# EasyEDA Pro project ProProject_三阶魔方机器人_2024-09-23.epro

# Schematic Schematic1
Create Date: 2023-12-15; Page Name: P1; Project Name: 三阶魔方机器人; Schematic Name: Schematic1; Update Date: 2023-12-15; Company: 嘉立创EDA; Page Size: A4; Version: V1.0
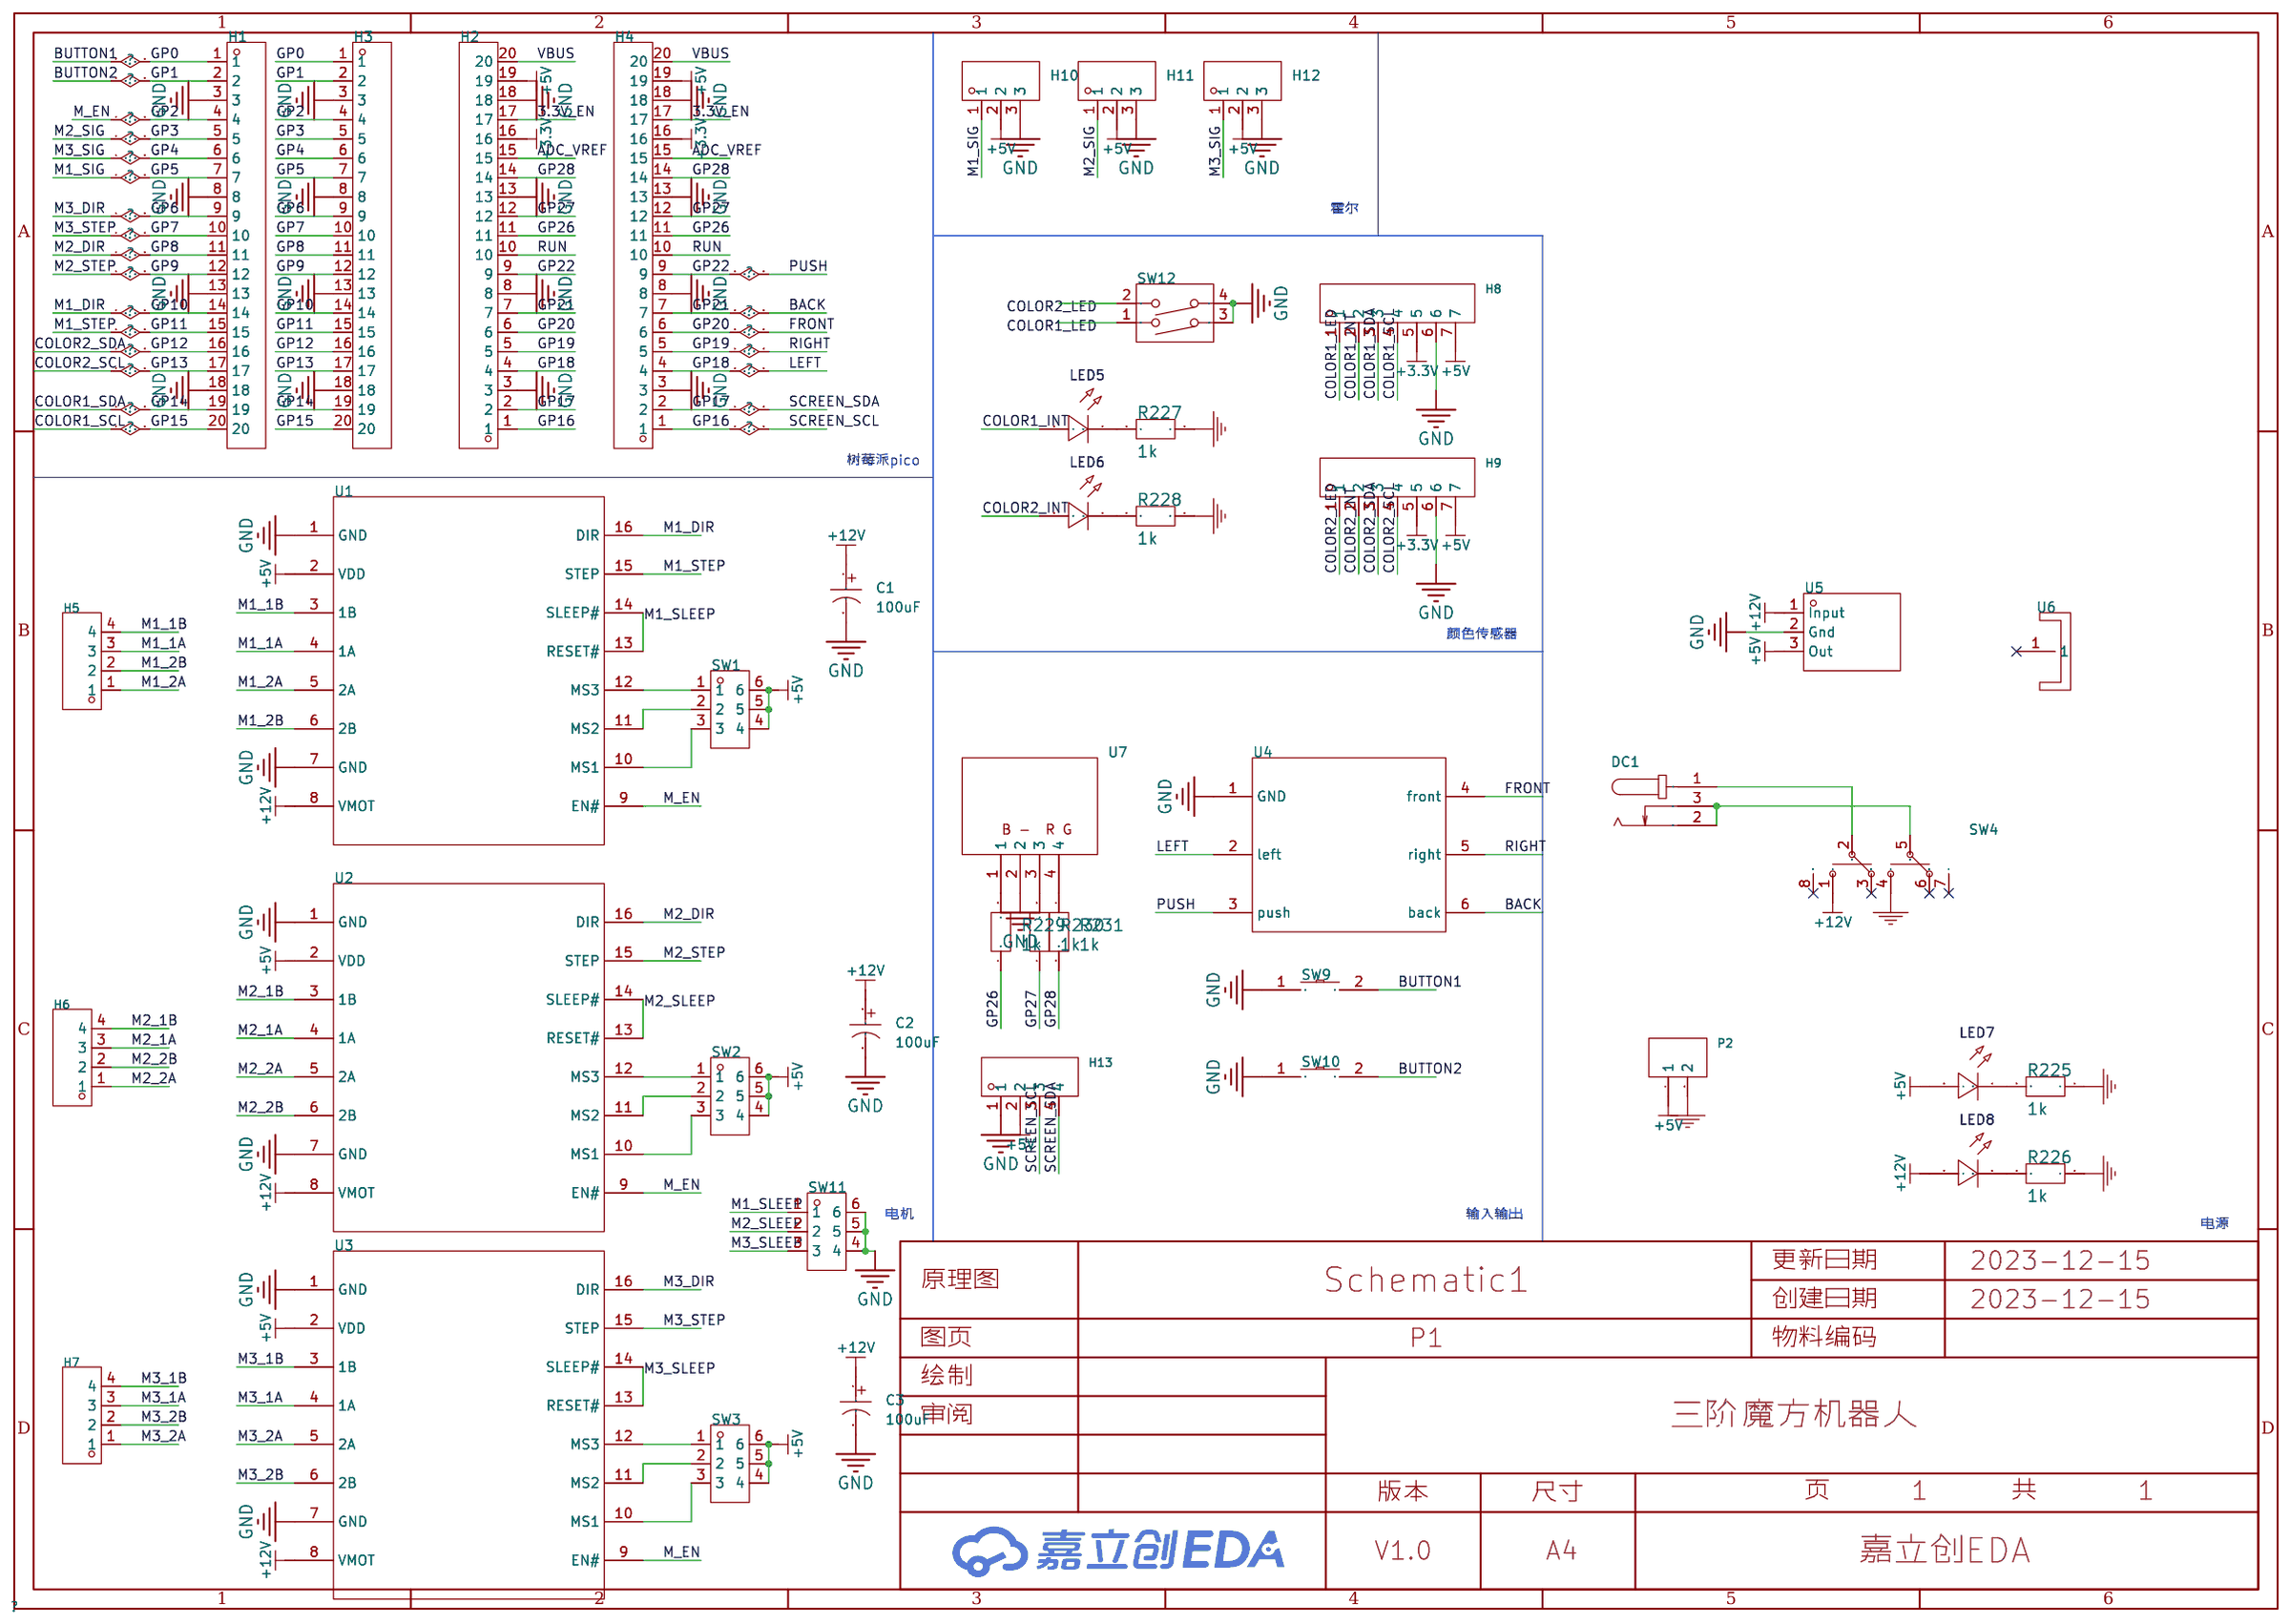
[diagram p0: schematic sheet]

## Parts
C1  100uF  [CAP-TH_BD5.0-P2.00-D0.8-FD]
C2  100uF  [CAP-TH_BD5.0-P2.00-D0.8-FD]
C3  100uF  [CAP-TH_BD5.0-P2.00-D0.8-FD]
DC1  DC-005-5A-2.5  [DC-IN-TH_DC-005-5A-2.5]
H1  -  [HDR-TH_20P-P2.54-V-M-1]
H2  -  [HDR-TH_20P-P2.54-V-M-1]
H3  -  [HDR-TH_20P-P2.54-V-M-1]
H4  -  [HDR-TH_20P-P2.54-V-M-1]
H5  -  [HDR-TH_4P-P2.54-V-M]
H6  -  [HDR-TH_4P-P2.54-V-M]
H7  -  [HDR-TH_4P-P2.54-V-M]
H8  -  [HDR-TH_7P-P2.54-V-M]
H9  -  [HDR-TH_7P-P2.54-V-M]
H10  -  [HDR-TH_3P-P2.54-V-M]
H11  -  [HDR-TH_3P-P2.54-V-M]
H12  -  [HDR-TH_3P-P2.54-V-M]
H13  -  [HDR-TH_4P-P2.54-V-M]
LED5  -  [LED_0805]
LED6  -  [LED_0805]
LED7  -  [LED_0805]
LED8  -  [LED_0805]
P2  2.54-1*2P母  [HDR-TH_2P-P2.54-V-F]
R225  1k  [R0805]
R226  1k  [R0805]
R227  1k  [R0805]
R228  1k  [R0805]
R229  1k  [R0805]
R230  1k  [R0805]
R231  1k  [R0805]
SW1  DS1040-03RN  [KEY-TH_DS1040-03RN]
SW2  DS1040-03RN  [KEY-TH_DS1040-03RN]
SW3  DS1040-03RN  [KEY-TH_DS1040-03RN]
SW4  2MD3T2B1M6RES  [SW-TH_2MD3T2B1M6RES]
SW9  TS-1101-C-W  [SW-SMD_L6.0-W3.3-LS8.0]
SW10  TS-1101-C-W  [SW-SMD_L6.0-W3.3-LS8.0]
SW11  DS1040-03RN  [KEY-TH_DS1040-03RN]
SW12  EDS102SZ  [SW-TH_DSWB02LHGET]
U1  -  [A4988模块]
U2  -  [A4988模块]
U3  -  [A4988模块]
U4  -  [直插五向开关]
U5  L7805CV  [TO-220-3_L10.0-W4.5-P2.54-L]
U6  15.5*10.5*21  [SINK-TH_L15.0-W10.5-H21.0]
U7  -  [直插RGB]

## Library data of the parts
C1-C3 = KS107M016D07RR0VH2FP0: 容值:100uF;精度:±20%;额定电压:16V;纹波电流:-;等效串联电阻:-;; LCSC Part Name: 100uF ±20% 16V; Supplier Part: C43803; Manufacturer: CX(承兴); Supplier Footprint: 插件,D5xL7mm; JLCPCB Part Class: Extended Part; Datasheet: https://atta.szlcsc.com/upload/public/pdf/source/20230817/0DB19D47181DB7F2222DAA6444591EF5.pdf; Supplier: LCSC; Tolerance: ±20%; Rated Voltage: 16V; φD: 5mm; L: 7mm; Lead Spacing: 2mm; Lifetime @ Temp: 1000hrs@105℃
DC1 = DC-005-5A-2.5: 连接器类型:DC电源插座;触点内径:2.5mm;触点外径:6.5mm;额定电流:5A;额定电压:24V;触头材质:黄铜;工作温度范围:-20℃~+70℃;焊接温度(最大值):260℃;; LCSC Part Name: DC电源插座 内径:2.5mm 外径:6.5mm; Supplier Part: C381115; Manufacturer: XKB Connectivity(中国星坤); Supplier Footprint: 插件; JLCPCB Part Class: 扩展库; Datasheet: https://atta.szlcsc.com/upload/public/pdf/source/20220930/9F6B678D272419D8FE16D336E354A545.pdf; Supplier: LCSC; Connector Type: DC电源插座; Inside Contact Diameter: 2.5mm; Outside Contact Diameter: 6.5mm; Current Rating (Max): 5A; Voltage Rating (Max): 24V; Contact Material: 黄铜; Operating Temperature Range: -20℃~+70℃; Welding Temperature (Max): 260℃
H1-H4 = HDR-M_2.54_1x20P: 间距:2.54mm;总PIN位数:20;排数:1;插针结构:-;行距:-;安装类型:直插;圆针/方针:-;额定电流:-;额定电压:-;配合针长度:-;塑高:-;触头材质:黄铜;触头镀层:-;颜色:黑色;; Supplier Part: C50981; Supplier Footprint: 插件
H5-H7 H13 = HDR-M_2.54_1x4P: Supplier Part: C492403; Supplier Footprint: 插件
H8 H9 = HDR-M_2.54_1x7P: Supplier Part: C492406; Supplier Footprint: 插件
H10-H12 = HDR-M_2.54_1x3P: Supplier Part: C2937625; Supplier Footprint: 插件
LED5-LED8 = LED_0805-G: Supplier Footprint: 0805
P2 = 2.54-1*2P母: 排数:单排;总孔位数:2;间距:2.54mm;插孔结构:1x2P;行距:-;安装类型:直插;塑高:-;触头材质:-;触头镀层:-;; LCSC Part Name: 2.54mm 1x2P; Supplier Part: C49661; Manufacturer: BOOMELE(博穆精密); Supplier Footprint: 直插,P=2.54mm; JLCPCB Part Class: Extended Part; Supplier: LCSC; Number of Rows: 单排; Number of Holes: 2; Pitch: 2.54mm; Holes Structure: 1x2P; Mounting Type: 直插
R225-R231 = 1k
SW1-SW3 SW11 = DS1040-03RN: 2.54mm拨动开关，平拔，3P，红色，镀金; Supplier Part: C3024969; Manufacturer: CONNFLY; Supplier Footprint: 插件; JLCPCB Part Class: Extended Part; Datasheet: https://atta.szlcsc.com/upload/public/pdf/source/20220524/E487E22DEF95345BB2C3C9897C5E0C2D.pdf; Supplier: LCSC
SW4 = 2MD3T2B1M6RES: 电路结构:双刀双掷;机械寿命:30000;钮柄形状:圆柱钮柄;引脚样式:PC引脚;安装方式:弯插;工作温度:-40℃~+85℃;; LCSC Part Name: 2M系列 钮子开关 摇头开关; Supplier Part: C545196; Manufacturer: Dailywell(德利威); Supplier Footprint: 插件; JLCPCB Part Class: Extended Part; Datasheet: https://atta.szlcsc.com/upload/public/pdf/source/20200324/C496170_954A7394085DEA4CF4EC9443DF401EBE.pdf; Supplier: LCSC; Circuit: 双刀双掷; Mechanical Life: 30000; Actuator Type: 圆柱钮柄; Pin Style: PC引脚; Mounting Style: 弯插; Operating Temperature: -40℃~+85℃
SW9 SW10 = TS-1101-C-W: 触点电流:50mA;额定电压(AC):-;额定电压(DC):12V;额定功率:-;绝缘电阻:-;电路结构:单刀单掷;安装方式:立贴;带灯:无;作用力:260gf;机械寿命:5万次;带支架:否;; LCSC Part Name: 立贴 6*3.6*2.5mm 轻触开关 一型3*6*2.5有白ZD b拉伸白色带淡绿按键 卷装; Supplier Part: C318938; Manufacturer: XKB Connectivity(中国星坤); Supplier Footprint: SMD; JLCPCB Part Class: 扩展库; Datasheet: https://atta.szlcsc.com/upload/public/pdf/source/20200227/C318938_C2E53B1EEDE37D980A33616AC086DE53.pdf; Supplier: LCSC; Contact Current: 50mA; Voltage Rating (DC): 12V; Circuit: 单刀单掷; Mounting Style: 立贴; Actuator Style: 矩形按钮; Actuator/Cap Color: 白色带淡绿; With Lamp: 无; Operating Force: 260gf; Mechanical Life: 5万次; Operating Temperature: -30℃~+85℃; Switch Length: 6mm; Switch Width: 3.6mm; Switch Height: 2.5mm; Strike Gundam: 否
SW12 = EDS102SZ: LCSC Part Name: 2P 2.54mm; Supplier Part: C2836796; Manufacturer: ECE(百容); Supplier Footprint: 插件; JLCPCB Part Class: Extended Part; Datasheet: https://atta.szlcsc.com/upload/public/pdf/source/20210528/C2836796_6A396D5B0CE755ACC640C5917AF1A92F.pdf; Supplier: LCSC
U1-U3 = A4988模块
U4 = 直插五向开关
U5 = L7805CV: 输出类型:固定;输出极性:正;最大输入电压:35V;输出电压:5V;输出电流:1.2A;电源纹波抑制比(PSRR):-;; LCSC Part Name: 输入35V 输出5V 1.2A; Supplier Part: C347289; Manufacturer: UMW(广东友台半导体); Supplier Footprint: TO-220; JLCPCB Part Class: Extended Part; Datasheet: https://atta.szlcsc.com/upload/public/pdf/source/20220307/F6F0EE8ADD73BB859488C12493DB7F7F.pdf; Supplier: LCSC; Output Type: 固定; Output Polarity: 正; Number of Outputs: 1; Maximum Input Voltage: 35V; Output Voltage: 5V; Output Current: 1.2A
U6 = 15.5*10.5*21: 产品尺寸:15.5*10.5*21MM;材 质:6063-T5;; LCSC Part Name: H型散热片; Supplier Part: C4649; Manufacturer: XSD(鑫顺达); JLCPCB Part Class: Extended Part; Datasheet: https://atta.szlcsc.com/upload/public/pdf/source/20171202/C4649_15122106328221160233.pdf; Supplier: LCSC; brand: XSD(鑫顺达); ProductSize: 15.5*10.5*21MM; Colour: 白色; TextureOfMaterial: 6063-T5; SurfaceTreatment: 本色洗白; Shape: H型; SpringBuckle: -；-；-；-；-；-；-；-
U7 = 直插RGB

## Nets
3.3V_EN: H2.17 H4.17
+3.3V: H2.16 H4.16 H8.5 H9.5
+5V: H2.19 H4.19 H8.7 H9.7 H10.2 H11.2 H12.2 H13.2 LED7.2(A) P2.1 SW1.4 SW1.5 SW1.6 SW2.4 SW2.5 SW2.6 SW3.4 SW3.5 SW3.6 U1.2(VDD) U2.2(VDD) U3.2(VDD) U5.3(Out)
+12V: C1.1 C2.1 C3.1 LED8.2(A) SW4.1 U1.8(VMOT) U2.8(VMOT) U3.8(VMOT) U5.1(Input)
GND: C1.2 C2.2 C3.2 H1.3 H1.8 H1.13 H1.18 H2.3 H2.8 H2.13 H2.18 H3.3 H3.8 H3.13 H3.18 H4.3 H4.8 H4.13 H4.18 H8.6 H9.6 H10.3 H11.3 H12.3 H13.1 P2.2 R225.1 R226.1 R227.1 R228.1 SW4.4 SW9.1 SW10.1 SW11.4 SW11.5 SW11.6 SW12.3 SW12.4 U1.1(GND) U1.7(GND) U2.1(GND) U2.7(GND) U3.1(GND) U3.7(GND) U4.1(GND) U5.2(Gnd) U7.2
VBUS: H2.20 H4.20
ADC_VREF: H2.15 H4.15
BACK: H2.7 H4.7 U4.6(back)
BUTTON1: H1.1 H3.1 SW9.2
BUTTON2: H1.2 H3.2 SW10.2
COLOR1_INT: H8.2 LED5.2(A)
COLOR1_LED: H8.1 SW12.1
COLOR1_SCL: H1.20 H3.20 H8.4
COLOR1_SDA: H1.19 H3.19 H8.3
COLOR2_INT: H9.2 LED6.2(A)
COLOR2_LED: H9.1 SW12.2
COLOR2_SCL: H1.17 H3.17 H9.4
COLOR2_SDA: H1.16 H3.16 H9.3
FRONT: H2.6 H4.6 U4.4(front)
GP2: H1.4 H3.4 U1.9(EN#) U2.9(EN#) U3.9(EN#)
GP3: H1.5 H3.5 H11.1
GP4: H1.6 H3.6 H12.1
GP5: H1.7 H3.7 H10.1
GP6: H1.9 H3.9 U3.16(DIR)
GP7: H1.10 H3.10 U3.15(STEP)
GP8: H1.11 H3.11 U2.16(DIR)
GP9: H1.12 H3.12 U2.15(STEP)
GP10: H1.14 H3.14 U1.16(DIR)
GP11: H1.15 H3.15 U1.15(STEP)
GP16: H2.1 H4.1 H13.3
GP17: H2.2 H4.2 H13.4
GP18: H2.4 H4.4 U4.2(left)
GP19: H2.5 H4.5 U4.5(right)
GP22: H2.9 H4.9 U4.3(push)
GP26: H2.11 H4.11 R229.1
GP27: H2.12 H4.12 R230.1
GP28: H2.14 H4.14 R231.2
M1_1A: H5.3 U1.4(1A)
M1_1B: H5.4 U1.3(1B)
M1_2A: H5.1 U1.5(2A)
M1_2B: H5.2 U1.6(2B)
M1_SLEEP: SW11.1 U1.13(RESET#) U1.14(SLEEP#)
M2_1A: H6.3 U2.4(1A)
M2_1B: H6.4 U2.3(1B)
M2_2A: H6.1 U2.5(2A)
M2_2B: H6.2 U2.6(2B)
M2_SLEEP: SW11.2 U2.13(RESET#) U2.14(SLEEP#)
M3_1A: H7.3 U3.4(1A)
M3_1B: H7.4 U3.3(1B)
M3_2A: H7.1 U3.5(2A)
M3_2B: H7.2 U3.6(2B)
M3_SLEEP: SW11.3 U3.13(RESET#) U3.14(SLEEP#)
RUN: H2.10 H4.10
$1N5148: DC1.1 SW4.2
$1N5149: DC1.2 DC1.3 SW4.5
$1N7569: R229.2 U7.1
$1N7593: R230.2 U7.3
$1N7617: R231.1 U7.4
$1N8391: SW1.1 U1.12(MS3)
$1N8392: SW1.2 U1.11(MS2)
$1N8393: SW1.3 U1.10(MS1)
$1N8417: SW2.1 U2.12(MS3)
$1N8418: SW2.2 U2.11(MS2)
$1N8419: SW2.3 U2.10(MS1)
$1N8443: SW3.1 U3.12(MS3)
$1N8444: SW3.2 U3.11(MS2)
$1N8445: SW3.3 U3.10(MS1)
$1N8627: LED5.1(C) R227.2
$1N8652: LED6.1(C) R228.2
$1N8677: LED7.1(C) R225.2
$1N8705: LED8.1(C) R226.2

Not connected (* = marked no-connect by the designer): SW4 3* 6* 7* 8*; U6 1*

## Notes on the sheet
- 霍尔
- 树莓派pico
- 颜色传感器
- 电机
- 输入输出
- 电源

# Board PCB1
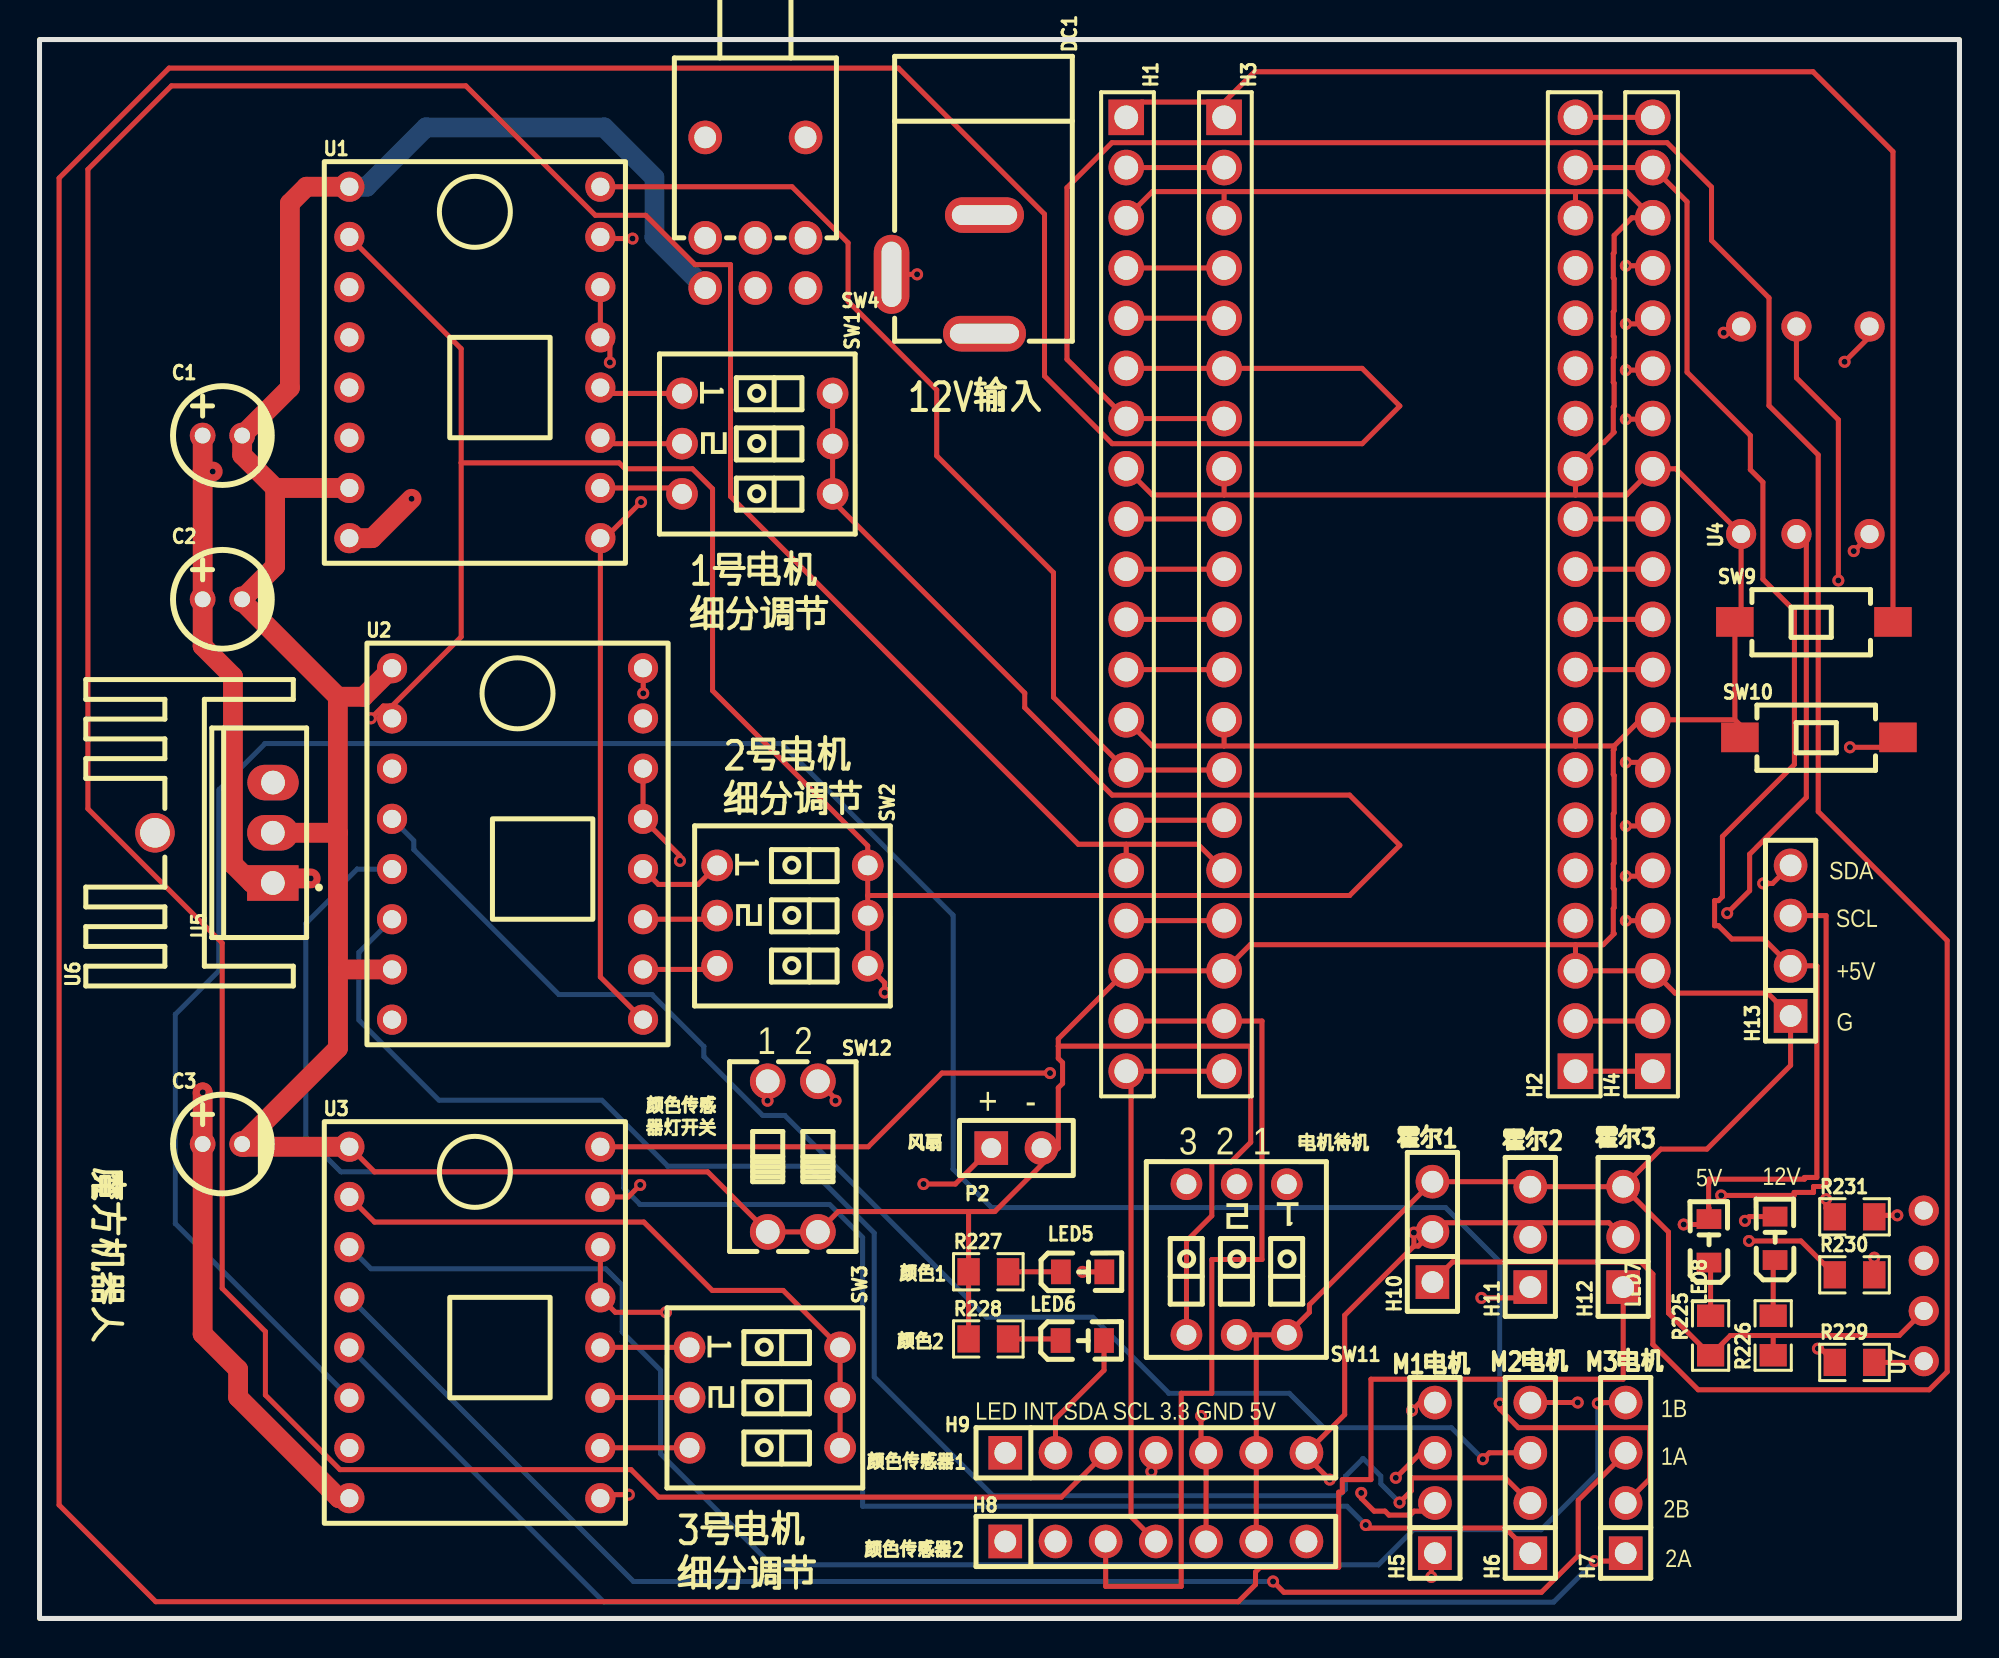
[diagram p1: board, top side]
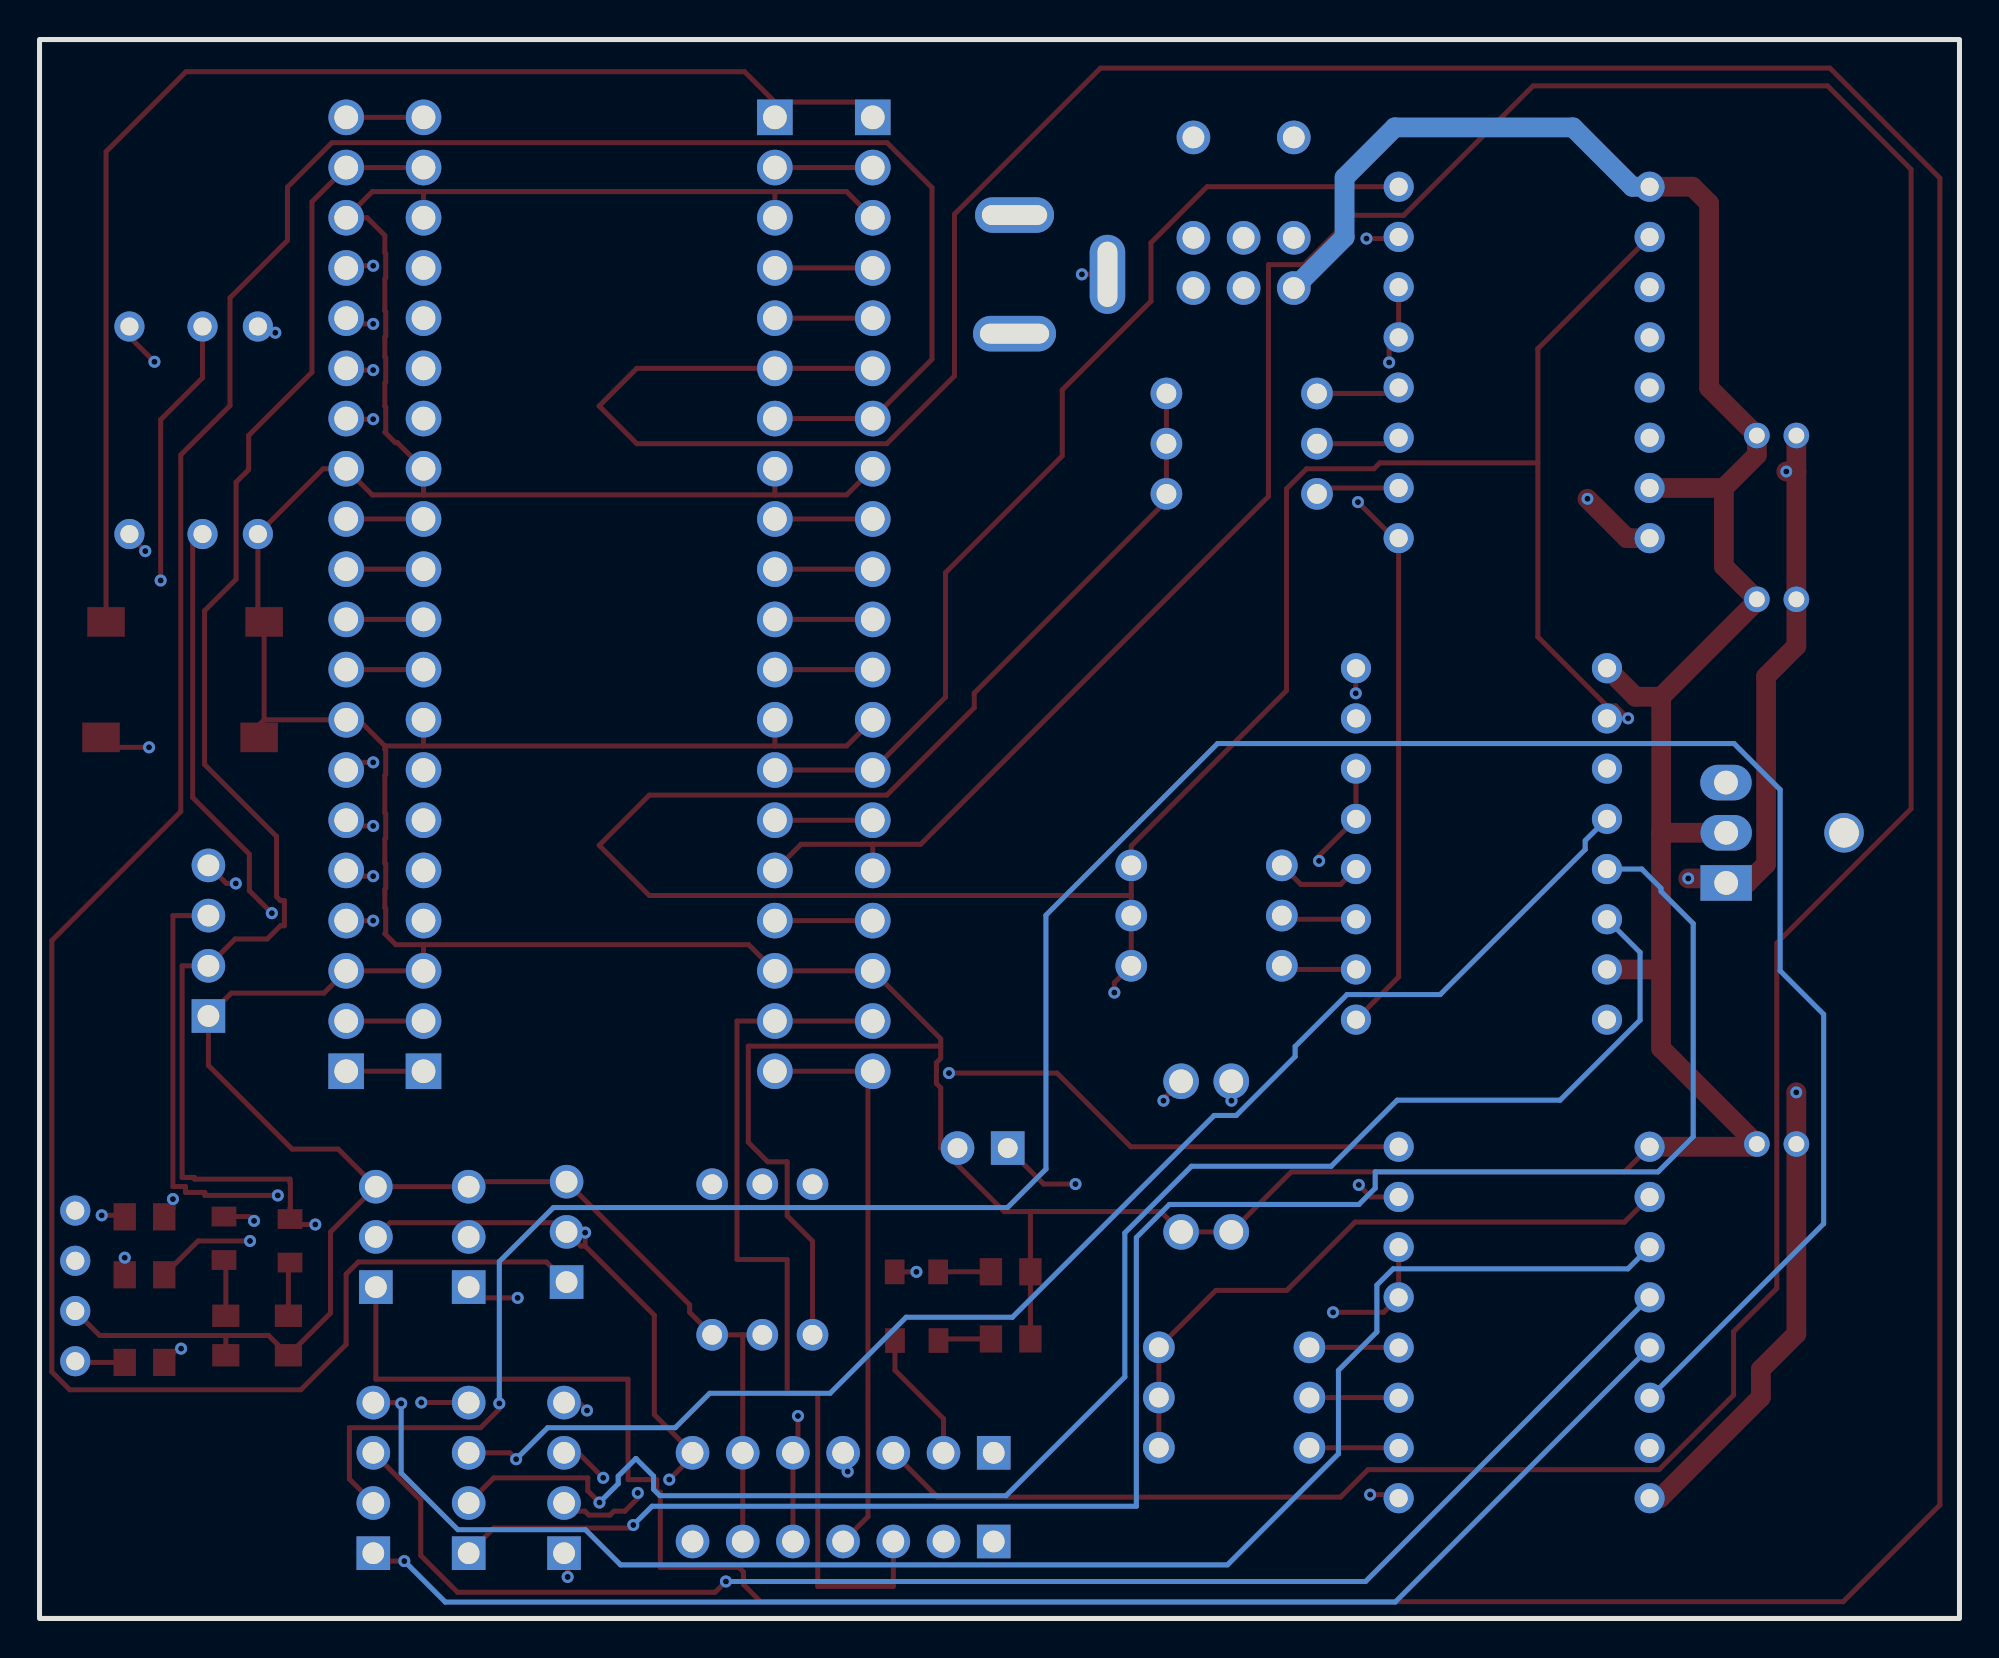
[diagram p2: board, bottom side, seen from below]

Outline 97.16 x 79.88 mm; copper layers: Top Layer, Inner1, Inner2, Bottom Layer. Coordinates in mm from the lower left corner of the outline.
Outline path: rectangle 0,79.88 97.16,0
Stack: Top Layer 0.035mm 外层铜厚1oz / Dielectric1 0.2104mm 7628 RC49% 8.6mil / Inner1 0.0152mm 内层铜厚 / Dielectric2 1.065mm 1.1mm H/HOZ 含铜 / Inner2 0.0152mm 内层铜厚 / Dielectric3 0.2104mm 7628 RC49% 8.6mil / Bottom Layer 0.035mm 外层铜厚1oz

## Design rules (mm)
template: JLCPCB Capability(Two Layers Board)
spacing copperThickness1oz (default): track to track 0.102, other pairs 0.152 to 0.3
spacing copperThickness2oz: track to track 0.203, other pairs 0.152 to 0.3
track width copperThickness1oz (default): min 0.127, default 0.254, max 2.54
track width copperThickness2oz: min 0.203, default 0.254, max 2.54
differential pair differentialPair (default): width min 0.127, default 0.254, max 2.54; gap min 0.152, default 0.152
via viaSize (default): diameter min 0.5, default 0.61, max 10; hole min 0.3, default 0.305, max 6.3

## Placement (name value [footprint] x y rotation side)
C1  100uF  [CAP-TH_BD5.0-P2.00-D0.8-FD]  9.25 59.85 0 top
C2  100uF  [CAP-TH_BD5.0-P2.00-D0.8-FD]  9.25 51.56 0 top
C3  100uF  [CAP-TH_BD5.0-P2.00-D0.8-FD]  9.25 24 0 top
DC1  DC-005-5A-2.5  [DC-IN-TH_DC-005-5A-2.5]  45.47 68 270 top
H1  -  [HDR-TH_20P-P2.54-V-M-1]  54.99 51.82 270 top
H2  -  [HDR-TH_20P-P2.54-V-M-1]  77.72 51.82 90 top
H3  -  [HDR-TH_20P-P2.54-V-M-1]  59.94 51.82 270 top
H4  -  [HDR-TH_20P-P2.54-V-M-1]  81.64 51.82 90 top
H5  -  [HDR-TH_4P-P2.54-V-M]  70.61 7.11 90 top
H6  -  [HDR-TH_4P-P2.54-V-M]  75.44 7.11 90 top
H7  -  [HDR-TH_4P-P2.54-V-M]  80.26 7.11 90 top
H8  -  [HDR-TH_7P-P2.54-V-M]  56.49 3.9 0 top
H9  -  [HDR-TH_7P-P2.54-V-M]  56.49 8.38 0 top
H10  -  [HDR-TH_3P-P2.54-V-M]  70.49 19.56 90 top
H11  -  [HDR-TH_3P-P2.54-V-M]  75.44 19.3 90 top
H12  -  [HDR-TH_3P-P2.54-V-M]  80.14 19.3 90 top
H13  -  [HDR-TH_4P-P2.54-V-M]  88.61 34.29 90 top
LED5  -  [LED_0805]  52.83 17.53 0 top
LED6  -  [LED_0805]  52.82 14.06 0 top
LED7  -  [LED_0805]  84.48 19.16 90 top
LED8  -  [LED_0805]  87.83 19.28 90 top
P2  2.54-1*2P母  [HDR-TH_2P-P2.54-V-F]  49.43 23.8 0 top
R225  1k  [R0805]  84.56 14.32 90 top
R226  1k  [R0805]  87.73 14.32 90 top
R227  1k  [R0805]  48.01 17.54 0 top
R228  1k  [R0805]  48.01 14.14 0 top
R229  1k  [R0805]  91.84 12.95 0 top
R230  1k  [R0805]  91.84 17.39 0 top
R231  1k  [R0805]  91.84 20.32 0 top
SW1  DS1040-03RN  [KEY-TH_DS1040-03RN]  36.32 59.44 270 top
SW2  DS1040-03RN  [KEY-TH_DS1040-03RN]  38.1 35.56 270 top
SW3  DS1040-03RN  [KEY-TH_DS1040-03RN]  36.7 11.18 270 top
SW4  2MD3T2B1M6RES  [SW-TH_2MD3T2B1M6RES]  36.22 71.12 180 top
SW9  TS-1101-C-W  [SW-SMD_L6.0-W3.3-LS8.0]  89.79 50.42 0 top
SW10  TS-1101-C-W  [SW-SMD_L6.0-W3.3-LS8.0]  90.04 44.58 0 top
SW11  DS1040-03RN  [KEY-TH_DS1040-03RN]  60.58 18.16 180 top
SW12  EDS102SZ  [SW-TH_DSWB02LHGET]  38.12 23.37 0 top
U1  -  [A4988模块]  15.68 72.44 0 top
U2  -  [A4988模块]  17.84 48.08 0 top
U3  -  [A4988模块]  15.68 23.87 0 top
U4  -  [直插五向开关]  86.11 54.86 90 top
U5  L7805CV  [TO-220-3_L10.0-W4.5-P2.54-L]  11.81 39.75 90 top
U6  15.5*10.5*21  [SINK-TH_L15.0-W10.5-H21.0]  5.84 39.75 90 top
U7  -  [直插RGB]  95.35 13.02 90 top

## Footprints (pads in the part's own frame, mm; a bottom-side part is the same pattern mirrored in y, then rotated)
A4988模块
  round 1.524 hole 0.914: 1(0,0) 2(0,-2.54) 3(0,-5.08) 4(0,-7.62) 5(0,-10.16) 6(0,-12.7) 7(0,-15.24) 8(0,-17.78) 9(12.7,-17.78) 10(12.7,-15.24) 11(12.7,-12.7) 12(12.7,-10.16) 13(12.7,-7.62) 14(12.7,-5.08) 15(12.7,-2.54) 16(12.7,0)
CAP-TH_BD5.0-P2.00-D0.8-FD
  round 1.3 hole 0.8: 1(-1,0) 2(1,0)
DC-IN-TH_DC-005-5A-2.5
  oval 1.8x4.2 hole 1x3.5: 1(3,2.352)
  oval 1.8x4 hole 1x3.3: 2(-3,2.352)
  oval 4x1.8 hole 3.3x1: 3(-0.001,-2.352)
HDR-TH_2P-P2.54-V-F
  rect 1.7x1.7 hole 1: 1(-1.27,0)
  round 1.7 hole 1: 2(1.27,0)
HDR-TH_3P-P2.54-V-M
  rect 1.7x1.7 hole 1.1: 1(-2.54,0)
  round 1.7 hole 1.1: 2(0,0) 3(2.54,0)
HDR-TH_4P-P2.54-V-M
  rect 1.7x1.7 hole 1.1: 1(-3.81,0)
  round 1.7 hole 1.1: 2(-1.27,0) 3(1.27,0) 4(3.81,0)
HDR-TH_7P-P2.54-V-M
  rect 1.7x1.7 hole 1.1: 1(-7.62,0)
  round 1.7 hole 1.1: 2(-5.08,0) 3(-2.54,0) 4(0,0) 5(2.54,0) 6(5.08,0) 7(7.62,0)
HDR-TH_20P-P2.54-V-M-1
  rect 1.8x1.8 hole 1.2: 1(-24.13,0)
  round 1.8 hole 1.2: 2(-21.59,0) 3(-19.05,0) 4(-16.51,0) 5(-13.97,0) 6(-11.43,0) 7(-8.89,0) 8(-6.35,0) 9(-3.81,0) 10(-1.27,0) 11(1.27,0) 12(3.81,0) 13(6.35,0) 14(8.89,0) 15(11.43,0) 16(13.97,0) 17(16.51,0) 18(19.05,0) 19(21.59,0) 20(24.13,0)
KEY-TH_DS1040-03RN
  round 1.6 hole 1: 1(-2.54,-3.81) 2(0,-3.81) 3(2.54,-3.81) 4(2.54,3.81) 5(0,3.81) 6(-2.54,3.81)
LED_0805
  rect 1x1.25 smd: 1(-1.15,0.005) 2(1.05,0.005)
R0805
  rect 1.133x1.377 smd: 1(-1,0) 2(1,0)
SINK-TH_L15.0-W10.5-H21.0
  round 2 hole 1.5: 1(0,0)
SW-SMD_L6.0-W3.3-LS8.0
  rect 1.9x1.5 smd: 1(-4,0) 2(4,0)
SW-TH_2MD3T2B1M6RES
  round 1.7 hole 1.1: 1(2.54,1.27) 2(0,1.27) 3(-2.54,1.27) 4(2.54,3.81) 5(0,3.81) 6(-2.54,3.81) 7(2.54,-3.81) 8(-2.54,-3.81)
SW-TH_DSWB02LHGET
  round 1.8 hole 1.2: 1(-1.27,3.81) 2(1.27,3.81) 3(-1.27,-3.81) 4(1.27,-3.81)
TO-220-3_L10.0-W4.5-P2.54-L
  rect 1.8x2.6 hole 1.2: 1(-2.54,0.005)
  oval 1.8x2.6 hole 1.2: 2(0,0.005) 3(2.54,-0.005)
直插RGB
  round 1.524 hole 0.914: 1(0,0) 2(2.54,0) 3(5.08,0) 4(7.62,0)
直插五向开关
  round 1.524 hole 0.914: 1(0,0) 2(0,-2.8) 3(0,-6.5) 4(10.5,0) 5(10.5,-2.8) 6(10.5,-6.5)

## Nets
As in the schematic.

Pads without a net: SW4 3 6 7 8; U6 1

## Via types
v1: diameter 0.61, hole 0.305, Top Layer to Bottom Layer, 61 vias

## Routing (per net, layer and track width the routed paths; a pad name or vN(x,y) marks a point on that pad's centre or on a via; arc(x,y) is an arc through that point)
3.3V_EN: length 4
  Top Layer w0.254: v1(80.27,68.44) 81.52,68.44 H4.17
  Inner2 w0.254: H2.17 80.16,68.33 v1(80.27,68.44)
+3.3V: length 104
  Top Layer w0.254: v1(80.27,65.5) 81.35,65.5 H4.16 ; H8.5 H9.5 58.78,8.64 v1(58.78,10.25)
  Inner1 w0.254: v1(58.78,10.25) 58.78,11.39 69.45,11.39 69.45,13.79 87.8,13.79 87.8,22.33 94.17,28.7 94.17,55.03 89.08,60.11 87.31,60.11 H4.16
  Inner2 w0.254: v1(80.27,65.5) 79.98,65.79 H2.16
+5V: length 335.4
  Top Layer w0.254: U3.2 16.95,20.06 30.58,20.06 34.04,16.6 37.63,16.6 SW3.6 SW3.5 SW3.4 ; 41.91,36.58 SW2.6 41.91,39.09 34.06,46.94 34.06,57.15 33.04,58.17 29.63,58.17 29.33,58.47 21.34,58.47 ; 41.91,36.58 SW2.5 SW2.4 42.77,32.16 v1(42.77,31.66) ; 41.91,36.58 66.29,36.58 68.83,39.12 66.29,41.66 54.28,41.66 49.85,46.08 49.85,46.82 40.13,56.54 SW1.4 SW1.5 SW1.6 ; 75.44,20.02 70.95,20.02 H10.2 69.77,18.84 69.55,18.84 ; 75.44,20.02 H11.2 ; 75.44,20.02 79.42,20.02 H12.2 ; 17.84,46.17 17.39,46.17 v1(16.77,45.54) ; 17.84,46.17 21.34,49.66 21.34,58.47 ; 17.84,46.17 U2.2 ; 69.55,18.84 66.04,15.34 66.04,10.32 H9.7 64.11,8.2 v1(65.29,7.03) ; 69.55,18.84 v1(69.55,19.52) ; 21.34,58.47 21.34,64.24 U1.2 ; P2.1 46.34,21.98 v1(44.73,21.98) ; v1(83.2,19.93) 84.2,19.93 LED7.2 84.48,20.77 84.46,20.77 84.46,22.04 84.48,22.04 84.48,22.23 89.31,22.23 89.31,22.31 89.94,22.31 89.94,33.02 H13.2 87.25,34.38 85.63,34.38 84.96,35.05 84.76,35.05 84.76,36.32 84.96,36.32 85.16,36.52 85.16,39.56 88.8,43.21 88.8,50.98 87.21,52.58 87.21,57.49 86.57,58.12 86.57,59.85 83.37,63.05 83.37,71.67 H4.19 H2.19
  Inner1 w0.254: v1(42.77,31.66) 48.16,26.27 P2.1 ; U5.3 15.06,45.54 v1(16.77,45.54) ; SW3.6 44.73,17.94 v1(44.73,21.98) ; H8.7 64.11,5.85 v1(65.29,7.03)
  Inner2 w0.254: v1(69.55,19.52) 52.44,19.52 P2.1 ; H12.2 82.57,19.3 v1(83.2,19.93)
+12V: length 197.6
  Top Layer w0.254: v1(86.3,20.12) 86.52,20.33 LED8.2
  Top Layer w1: U1.8 16.83,54.66 v1(18.83,56.65) ; v1(8.76,58.03) 8.25,58.03 ; 8.25,58.03 C2.1 8.25,49.2 9.79,47.66 9.79,38.16 10.74,37.21 U5.1 12.04,37.44 v1(13.72,37.44) ; 8.25,58.03 C1.1 ; U3.8 15.15,6.09 10.05,11.19 10.05,12.6 8.25,14.4 C3.1 8.25,26.61 v1(8.26,26.62)
  Inner1 w1: SW4.1 33.69,70.45 29.84,74.3 24.77,74.3 18.83,68.36 v1(18.83,56.65) ; v1(8.26,26.62) 11.81,30.17 U5.1 ; U2.8 13.72,34.41 v1(13.72,37.44)
  Inner2 w0.254: U2.8 19.11,31.57 31.64,31.57 31.64,28.62 41.08,28.62 51.37,18.33 72.24,18.33 73.71,16.86 73.71,15.95 74.28,15.39 82.49,15.39 84.85,17.75 84.85,18.67 v1(86.3,20.12)
  Inner2 w1: U1.8 12.14,54.66 v1(8.76,58.03)
GND: length 446.7
  Top Layer w0.254: H3.8 59.94,56.84 ; 59.94,56.84 56.31,56.84 H1.8 ; 59.94,56.84 77.72,56.84 ; H1.13 56.31,44.14 59.94,44.14 ; 79.68,44.14 79.68,43.97 79.64,43.93 79.64,42.7 79.68,42.65 79.68,40.75 79.64,40.71 79.64,39.48 79.68,39.44 79.68,38.21 79.64,38.17 79.64,36.94 79.68,36.9 79.68,35.96 79.64,35.92 79.64,34.69 79.68,34.64 79.13,34.09 77.72,34.09 ; 79.68,44.14 77.72,44.14 ; 79.68,44.14 81,45.47 H4.8 85.79,45.47 ; 47.01,20.59 48.34,20.59 51.55,23.8 ; 47.01,20.59 R227.1 R228.1 ; 47.01,20.59 40.42,20.59 SW12.4 SW12.3 33.81,22.6 16.95,22.6 U3.1 ; 61.57,14.35 H9.6 H8.6 ; 61.57,14.35 SW11.5 ; 61.57,14.35 SW11.6 64.26,15.49 64.26,15.87 H10.3 75.18,22.1 H11.3 H12.3 ; 59.94,44.14 77.72,44.14 ; 59.94,44.14 H3.13 ; 77.72,44.14 H2.8 ; 77.72,72.19 80.31,72.19 H4.18 80.58,70.87 79.68,69.97 79.68,69.1 79.64,69.05 79.64,67.83 79.68,67.78 79.68,66.15 79.64,66.11 79.64,64.88 79.68,64.84 79.68,63.82 79.64,63.77 79.64,62.54 79.68,62.5 79.68,61.33 79.64,61.29 79.64,60.06 79.68,60.02 79.15,59.49 79.05,59.49 H2.13 77.72,56.84 ; 77.72,72.19 59.94,72.19 ; 77.72,72.19 H2.18 ; 85.79,45.47 SW9.1 86.11,50.74 U4.1 82.8,58.17 H4.13 80.31,56.84 77.72,56.84 ; 85.79,45.47 86.04,45.21 SW10.1 ; H1.3 56.31,72.19 59.94,72.19 ; 59.94,72.19 H3.3 ; 77.72,34.09 H2.3 H4.3 82.76,31.64 87.45,31.64 H13.1 88.61,27.98 84.37,23.75 82.04,23.75 H12.3 ; 77.72,34.09 61.27,34.09 H3.18 H1.18 51.55,29.33 51.55,28.96 ; 87.73,14.32 94.11,14.32 U7.2 ; 87.73,14.32 85.56,14.32 R225.1 82.43,15.45 82.43,19.55 H12.3 ; 87.73,14.32 R226.1 ; 51.55,23.8 P2.2 ; 51.55,23.8 51.55,26.85 51.77,27.07 51.77,28.12 51.55,28.34 51.55,28.96 ; 51.55,28.96 61.29,28.96 61.29,24.09 60.31,23.1 59.32,23.1 59.32,20.37 58.04,19.09 SW11.4
  Top Layer w1: 11.92,57.2 10.25,58.86 C1.2 12.67,62.26 12.67,71.6 13.51,72.44 U1.1 ; 11.92,57.2 11.92,53.23 C2.2 10.25,51.47 15.1,46.63 ; 11.92,57.2 U1.7 ; 15.1,32.84 15.1,39.74 15.1,39.75 ; 15.1,32.84 U2.7 ; 15.1,32.84 15.1,28.85 C3.2 10.39,23.87 U3.1 ; 15.1,46.63 16.39,46.63 U2.1 ; 15.1,46.63 15.1,39.75 ; 15.1,39.75 U5.2
  Inner1 w1: C3.2 13.08,21.18 13.08,11.22 U3.7
  Bottom Layer w1: U1.1 16.56,72.44 19.56,75.44 28.57,75.44 31.12,72.9 31.12,69.88 SW4.4
VBUS: length 3.9
  Top Layer w0.254: H2.20 H4.20
ADC_VREF: length 4
  Top Layer w0.254: v1(80.27,63.16) 81.55,63.16 H4.15
  Inner2 w0.254: H2.15 80.18,63.25 v1(80.27,63.16)
BACK: length 38.6
  Top Layer w0.254: v1(91.34,63.58) 92.61,64.85 U4.6 ; v1(80.27,43.31) 81.25,43.31 H4.7
  Inner2 w0.254: v1(91.34,63.58) 84.66,56.9 76.48,56.9 76.48,44.17 H2.7 79.89,42.93 v1(80.27,43.31)
BUTTON1: length 66
  Top Layer w0.254: H1.1 55.76,76.72 59.94,76.72 ; 59.94,76.72 61.48,78.25 89.74,78.25 93.79,74.21 SW9.2 ; 59.94,76.72 H3.1
BUTTON2: length 61.5
  Top Layer w0.254: SW10.2 93.54,44.07 v1(91.61,44.07) ; H1.2 H3.2
  Inner1 w0.254: H3.2 61.65,71.7 61.65,66.42 68.63,59.44 82.35,59.44 83.95,57.83 83.95,55.32 85.5,53.77 90.97,53.77 91.17,53.57 91.17,53.37 91.42,53.37 91.66,53.13 91.66,51.9 91.61,51.86 v1(91.61,44.07)
COLOR1_INT: length 15.3
  Top Layer w0.254: v1(52.78,17.54) LED5.2
  Inner1 w0.254: H8.2 52.78,5.27 v1(52.78,17.54)
COLOR1_LED: length 32.4
  Top Layer w0.254: SW12.1 36.84,27.17 v1(36.84,26.19)
  Inner2 w0.254: H8.1 43.48,3.9 35.61,11.76 35.61,24.96 v1(36.84,26.19)
COLOR1_SCL: length 29.3
  Top Layer w0.254: H8.4 55.23,5.15 55.23,27.69 ; 55.23,27.69 H3.20 ; 55.23,27.69 H1.20
COLOR1_SDA: length 45.7
  Top Layer w0.254: H1.19 H3.19 61.86,30.23 61.86,18.16 59.32,18.16 59.32,11.39 57.77,11.39 57.77,1.62 53.95,1.62 H8.3
COLOR2_INT: length 6.7
  Top Layer w0.254: 53.87,14.06 53.87,12.56 51.41,10.1 H9.2
COLOR2_LED: length 22.7
  Top Layer w0.254: v1(40.28,26.19) 40.28,26.29 SW12.2
  Inner2 w0.254: H9.1 42.31,14.95 42.31,24.17 v1(40.28,26.19)
COLOR2_SCL: length 34.4
  Top Layer w0.254: v1(56.26,7.43) 56.26,8.15 H9.4 ; H1.17 H3.17
  Inner1 w0.254: H1.17 56.26,34.04 v1(56.26,7.43)
COLOR2_SDA: length 195.2
  Top Layer w0.254: H1.16 54.99,39.17 ; 54.99,39.17 58.62,39.17 H3.16 ; 54.99,39.17 52.56,39.17 34.97,56.77 34.97,68.49 33.17,68.49 30.67,70.99 28.12,70.99 21.58,77.54 6.67,77.54 2.45,73.31 2.45,40.97 9.24,34.17 9.24,16.7 11.43,14.51 11.43,11.3 15.2,7.53 29.93,7.53 31.32,6.14 51.71,6.14 H9.3
FRONT: length 43.7
  Top Layer w0.254: H4.6 81.35,40.1 v1(80.27,40.1) ; U4.4 85.79,65.05 v1(85.22,65.05)
  Inner2 w0.254: v1(85.22,65.05) 85.22,64.85 82.35,61.98 76.91,61.98 68.6,53.66 68.6,49.51 H2.6 79.98,40.39 v1(80.27,40.1)
GP2: length 90.3
  Top Layer w0.254: v1(30.44,56.48) 28.61,54.66 U1.9 28.38,32.45 U2.9 ; H1.4 H3.4 ; U3.9 28.56,6.26 v1(29.82,6.26)
  Inner1 w0.254: v1(29.82,6.26) 29.56,6.52 29.56,29.32 U2.9
  Inner2 w0.254: H1.4 48.79,68.33 46.85,66.39 46.02,66.39 44.88,65.24 44.88,62.38 40.66,58.17 32.01,58.17 30.44,56.6 v1(30.44,56.48)
GP3: length 64.1
  Top Layer w0.254: H1.5 H3.5 ; v1(72.96,16.22) 74.89,16.22 H11.1
  Inner1 w0.254: v1(72.96,16.22) 72.96,21.52 69.62,24.86 67.07,24.86 61.18,30.75 61.18,64.55 H3.5
GP4: length 261.8
  Top Layer w0.254: H1.6 H3.6 66.93,63.25 68.83,61.34 66.93,59.44 54.28,59.44 50.86,62.86 50.86,71.05 43.46,78.44 6.56,78.44 0.99,72.87 0.99,5.74 5.88,0.85 60.66,0.85 61.53,1.72 61.53,2.35 61.77,2.59 65.74,2.59 65.74,6.39 65.92,6.39 65.92,7.03 67.37,7.03 67.37,12.11 80.14,12.11 H12.1
GP5: length 148.9
  Top Layer w0.254: H10.1 71.5,18.04 81.02,18.04 81.64,17.42 81.64,13.86 83.93,11.57 95.62,11.57 96.53,12.48 96.53,34.3 90.01,40.82 90.01,58.87 87.52,61.36 87.52,66.81 84.61,69.72 84.61,72.42 82.36,74.66 54.27,74.66 51.99,72.39 51.99,63.7 H1.7 H3.7
GP6: length 61.8
  Top Layer w0.254: v1(51.13,27.59) 45.66,27.59 41.94,23.87 U3.16 ; H1.9 H3.9
  Inner1 w0.254: v1(51.13,27.59) 51.13,33.43 54.28,36.58 55.7,36.58 57.7,38.57 57.7,53.38 H3.9
GP7: length 65.4
  Top Layer w0.254: U3.15 29.79,21.33 v1(30.4,21.93) ; H1.10 H3.10
  Inner1 w0.254: H1.10 56.23,51.85 56.23,39.12 52.84,39.12 49.44,35.72 49.44,21.62 48.21,20.39 45.23,23.37 31.83,23.37 v1(30.4,21.93)
GP8: length 32.2
  Top Layer w0.254: H1.11 H3.11 ; U2.16 30.55,48.06 v1(30.55,46.81)
  Inner2 w0.254: v1(30.55,46.81) 34.29,50.55 H1.11
GP9: length 30.4
  Top Layer w0.254: H1.12 H3.12
  Inner2 w0.254: U2.15 52.52,45.54 54.99,48.01 H1.12
GP10: length 51.2
  Top Layer w0.254: H3.14 H1.14 51.31,46.61 51.31,52.91 45.4,58.82 45.4,62.16 40.91,66.64 40.91,69.6 38.08,72.44 U1.16
GP11: length 52
  Top Layer w0.254: U1.15 28.46,69.81 v1(30.01,69.81) ; H1.15 H3.15
  Inner1 w0.254: H1.15 49.16,40.39 35.06,54.48 35.06,68.58 31.24,68.58 v1(30.01,69.81)
GP16: length 32.9
  Top Layer w0.254: H2.1 H4.1 ; H13.3 90.4,35.56 90.4,21.85 89.77,21.85 89.77,21.55 88.79,21.55 88.79,21.4 v1(85.1,21.4)
  Inner2 w0.254: v1(85.1,21.4) 85.1,24.22 H4.1
GP17: length 39.4
  Top Layer w0.254: H2.2 H4.2 ; H13.4 87.7,37.19 v1(87.22,37.19)
  Inner1 w0.254: v1(87.22,37.19) 87.22,18.44 85.89,18.44 84.56,19.77 84.56,20.72 84.46,20.81 84.46,21.99 84.56,22.09 84.56,27.3 H4.2
GP18: length 28.9
  Top Layer w0.254: H4.4 81.63,35.3 v1(80.27,35.3) ; v1(85.4,35.68) 86.54,36.82 86.54,38.67 89.41,41.54 89.41,54.36 U4.2
  Inner1 w0.254: v1(85.4,35.68) 82.01,35.68 H4.4
  Inner2 w0.254: H2.4 80.27,35.31 v1(80.27,35.3)
GP19: length 50.9
  Top Layer w0.254: v1(91.03,52.52) 91.03,60.65 88.91,62.77 U4.5 ; v1(80.27,37.56) 81.35,37.56 H4.5
  Inner1 w0.254: v1(91.03,52.52) 85.66,52.52 83.44,54.74 83.44,55.8 82.35,56.9 80.93,56.9 79.24,55.22 79.24,38.58 v1(80.27,37.56)
  Inner2 w0.254: H2.5 79.98,37.85 v1(80.27,37.56)
GP22: length 24.2
  Top Layer w0.254: v1(91.8,54) 92.61,54.8 U4.3 ; H2.9 H4.9
  Inner2 w0.254: H2.9 79.68,49.96 79.68,53.11 80.93,54.36 82.88,54.36 82.88,54.06 83.17,53.77 91.57,53.77 v1(91.8,54)
GP26: length 47.9
  Top Layer w0.254: v1(89.99,13.65) 90.15,13.65 R229.1 ; H2.11 H4.11
  Inner2 w0.254: H4.11 82.93,51.8 82.93,32.64 87.25,28.32 87.25,16.39 v1(89.99,13.65)
GP27: length 48.9
  Top Layer w0.254: H2.12 H4.12 ; R230.1 89.13,19.1 v1(86.5,19.1)
  Inner1 w0.254: H4.12 82.93,54.33 82.93,38.34 84.28,36.99 85.3,36.99 85.64,36.65 85.64,36.52 85.84,36.32 86.04,36.32 86.04,35.05 85.84,35.05 85.64,34.85 85.64,22.09 85.73,21.99 85.73,20.81 85.64,20.72 85.64,19.62 86.07,19.19 86.42,19.19 v1(86.5,19.1)
GP28: length 72.5
  Top Layer w0.254: R231.2 92.92,20.4 v1(94.01,20.4) ; v1(80.27,60.67) 81.61,60.67 H4.14
  Inner1 w0.254: v1(80.27,60.67) 79.48,61.47 79.48,65.61 80.93,67.06 92.64,67.06 95.36,64.33 95.36,24.06 94.01,22.71 v1(94.01,20.4)
  Inner2 w0.254: H2.14 80.24,60.71 v1(80.27,60.67)
M1_1A: length 126.8
  Top Layer w0.254: v1(68.63,7.12) 69.9,8.38 H5.3
  Inner2 w0.254: U1.4 17.43,64.82 17.43,51.37 15.1,51.37 15.1,27.08 18.57,27.08 22.04,23.61 22.04,1.62 60.31,1.62 60.31,5.68 67.73,5.68 67.73,7.12 v1(68.63,7.12)
M1_1B: length 118
  Top Layer w0.254: H5.4 69.85,10.92 v1(69.45,10.52)
  Inner1 w0.254: U1.3 17.43,65.61 17.43,56.86 22.37,51.93 22.37,10.4 31.92,0.85 62.96,0.85 66.03,3.92 66.03,7.1 v1(69.45,10.52)
M1_2A: length 137.7
  Top Layer w0.254: v1(70.43,2.1) 70.43,3.12 H5.1
  Inner2 w0.254: v1(70.43,2.1) 69.49,1.16 6.47,1.16 2.45,5.17 2.45,55.55 9.18,62.28 U1.5
M1_2B: length 138.9
  Top Layer w0.254: v1(66.88,6.35) 66.88,6.08 67.53,5.43 68.08,5.43 68.29,5.23 69.36,5.23 69.56,5.43 70.2,5.43 H5.2
  Inner2 w0.254: U1.6 16.87,60.93 16.87,63.55 14.42,63.55 11.96,66 14.42,68.45 16.31,68.45 23.97,60.79 23.97,43.18 20.06,39.28 17.5,39.28 16.16,37.94 16.16,30.27 22.51,23.93 22.51,10.26 30.37,2.4 51.81,2.4 52.69,3.28 52.69,4.51 54.53,6.35 v1(66.88,6.35)
M1_SLEEP: length 74
  Top Layer w0.254: v1(28.86,63.55) 28.86,64.33 U1.13 U1.14
  Inner2 w0.254: v1(28.86,63.55) 29.59,63.55 29.59,51.43 29.46,51.3 29.46,39.3 44.73,39.3 52.53,31.5 60.66,31.5 63.12,29.03 SW11.1
M2_1A: length 71.7
  Top Layer w0.254: v1(73.04,8.06) 73.36,8.38 H6.3
  Bottom Layer w0.254: v1(73.04,8.06) 71.44,9.65 64.98,9.65 63.24,11.39 57.15,11.39 53.3,15.24 47.92,15.24 37.72,25.45 36.6,25.45 33.62,28.43 33.62,28.94 30.99,31.57 26.28,31.57 18.94,38.9 18.94,39.35 U2.4
M2_1B: length 202.8
  Top Layer w0.254: v1(77.84,10.93) 75.44,10.93 H6.4
  Inner1 w0.254: v1(77.84,10.93) 79.11,9.65 84.83,9.65 86.74,11.55 95.61,11.55 96.45,12.39 96.45,72.21 91.46,77.2 18.74,77.2 14.6,73.06 14.6,54.03 16.33,52.3 17.7,52.3 20.8,49.2 20.8,45.95 U2.3
M2_2A: length 95.5
  Top Layer w0.254: v1(67.11,4.73) 67.26,4.57 74.16,4.57 H6.1
  Bottom Layer w0.254: U2.5 16.07,37.92 15.1,36.94 15.1,36.79 13.47,35.16 13.47,24.37 15.25,22.6 29.56,22.6 29.56,21.77 30.39,20.95 39.98,20.95 41.65,19.28 41.65,5.68 66.16,5.68 v1(67.11,4.73)
M2_2B: length 83.1
  Top Layer w0.254: H6.2 74.17,7.11 69.41,7.11 69.41,6.46 v1(68.82,5.87)
  Bottom Layer w0.254: U2.6 16.16,33.7 16.16,30.27 20.21,26.22 28.45,26.22 31.8,22.88 38.86,22.88 42.24,19.51 42.24,12.22 48.25,6.21 65.76,6.21 66.08,6.53 66.08,7.2 66.98,8.09 67.87,7.2 67.87,6.82 v1(68.82,5.87)
M2_SLEEP: length 43.4
  Top Layer w0.254: U2.14 U2.13 32.41,38.59 v1(32.41,38.33)
  Inner2 w0.254: v1(32.41,38.33) 32.41,33.13 36.45,29.08 47.77,29.08 51.12,25.72 56.82,25.72 SW11.2
M3_1A: length 75.3
  Top Layer w0.254: v1(62.42,1.87) 62.97,1.32 76,1.32 77.86,3.19 77.86,5.98 H7.3
  Bottom Layer w0.254: v1(62.42,1.87) 30.05,1.87 U3.4
M3_1B: length 80.6
  Top Layer w0.254: v1(78.85,10.88) 78.9,10.92 H7.4
  Bottom Layer w0.254: U3.3 16.78,17.69 28.66,17.69 29.48,16.87 29.48,14.5 31.43,12.55 31.43,8.33 37.04,2.71 67.75,2.71 69.53,4.49 75.99,4.49 78.85,7.36 v1(78.85,10.88)
M3_2A: length 70.9
  Top Layer w0.254: H7.1 79.87,2.9 v1(78.7,2.9)
  Bottom Layer w0.254: U3.5 28.55,0.83 76.62,0.83 v1(78.7,2.9)
M3_2B: length 139.2
  Top Layer w0.254: H7.2 81.47,7.05 81.47,9.65 74.84,9.65 73.89,10.6 v1(73.89,10.88)
  Bottom Layer w0.254: v1(73.89,10.88) 73.89,18.05 71.15,20.79 48.17,20.79 46.23,22.73 46.23,35.58 37.54,44.27 11.41,44.27 9.08,41.93 9.08,32.77 6.87,30.57 6.87,19.97 U3.6
M3_SLEEP: length 62.9
  Top Layer w0.254: v1(31.7,15.49) 29.14,15.49 U3.13 U3.14
  Inner1 w0.254: SW11.3 59.32,20.69 59.32,13.31 57.77,11.76 57.77,3.28 56.12,1.62 38.13,1.62 31.7,8.06 v1(31.7,15.49)
RUN: length 3.9
  Top Layer w0.254: H2.10 H4.10
$1N5148: length 20.9
  Inner1 w1: SW4.2 36.58,70.2 36.58,72.14 40.89,72.14 41.02,72.01 41.02,65.15 41.53,64.64 47.46,64.64 DC1.1
$1N5149: length 15.7
  Top Layer w0.254: v1(44.41,68) DC1.3 ; SW4.5 36.19,67.34 v1(36.19,67.44)
  Inner1 w1: DC1.2 44.82,68 v1(44.41,68)
  Inner2 w1: DC1.3 40.52,65.41 36.83,65.41 36.19,66.04 v1(36.19,67.44)
$1N7569: length 2.5
  Top Layer w0.254: R229.2 95.28,12.95 U7.1
$1N7593: length 3.4
  Top Layer w0.254: v1(92.84,18.25) R230.2
  Inner2 w0.254: U7.3 93,18.1 v1(92.84,18.25)
$1N7617: length 7.3
  Top Layer w0.254: R231.1 90.4,20.76 v1(90.4,21.22)
  Inner1 w0.254: v1(90.4,21.22) 92.26,19.37 94.08,19.37 U7.4
$1N8391: length 4.3
  Top Layer w0.254: U1.12 28.68,61.98 SW1.1
$1N8392: length 4.3
  Top Layer w0.254: SW1.2 28.68,59.44 U1.11
$1N8393: length 4.3
  Top Layer w0.254: U1.10 32.21,57.2 SW1.3
$1N8417: length 4.5
  Top Layer w0.254: SW2.1 33.33,37.14 31.32,37.14 U2.12
$1N8418: length 3.8
  Top Layer w0.254: U2.11 34.11,35.38 SW2.2
$1N8419: length 3.8
  Top Layer w0.254: SW2.3 34.11,32.84 U2.10
$1N8443: length 4.5
  Top Layer w0.254: U3.12 28.39,13.72 SW3.1
$1N8444: length 4.5
  Top Layer w0.254: SW3.2 28.39,11.18 U3.11
$1N8445: length 4.5
  Top Layer w0.254: U3.10 28.39,8.64 SW3.3
$1N8627: length 2.7
  Top Layer w0.254: R227.2 51.68,17.54 LED5.1
$1N8652: length 2.7
  Top Layer w0.254: LED6.1 51.59,14.14 R228.2
$1N8677: length 2.7
  Top Layer w0.254: R225.2 84.56,17.92 LED7.1
$1N8705: length 2.9
  Top Layer w0.254: LED8.1 87.73,18.04 R226.2

## Text on the board
Top Silkscreen Layer: 颜色传感 / 器灯开关 | 颜色传感器2 | 颜色传感器1 | 颜色2 | 颜色1 | 风扇 | 电机待机 | LED INT SDA SCL 3.3 GND 5V | M1电机 | 霍尔1 | M2电机 | 霍尔2 | M3电机 | 霍尔3 | 1B | 1A | 2B | 2A | 5V | 12V | SDA | SCL | G | +5V | 3号电机 / 细分调节 | 1号电机 / 细分调节 | 2号电机 / 细分调节 | 1  2 | 12V输入 | +   - | 3  2  1 | 魔方机器人
